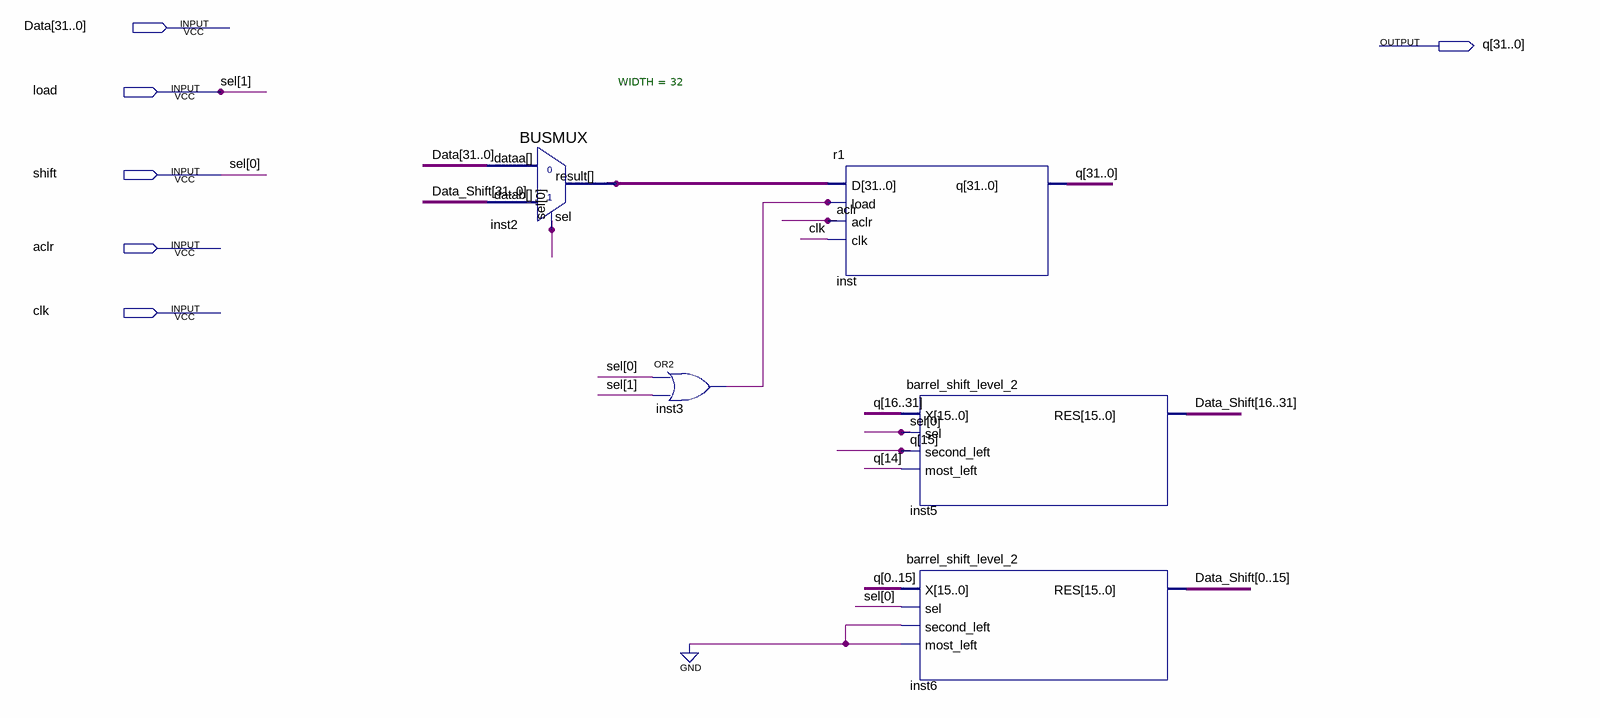
[diagram p0: schematic sheet]
// Quartus schematic r4.bdf as structural Verilog: 5 symbols, 6 pins
module r4 (
  input  [31:0] Data,
  input  load,
  input  shift,
  input  aclr,
  input  clk,
  output [31:0] q
);

  wire inst3_out;
  wire [31:0] Data_Shift, inst2_result;

  BUSMUX #(.WIDTH(32)) inst2 (.datab(Data_Shift), .sel(shift), .dataa(Data), .result(inst2_result));
  or inst3 (inst3_out, shift, load);
  r1 inst (.D(inst2_result), .load(inst3_out), .aclr(aclr), .clk(clk), .q(q));
  barrel_shift_level_2 inst5 (
    .X({q[16], q[17], q[18], q[19], q[20], q[21], q[22], q[23], q[24], q[25], q[26], q[27], q[28], q[29], q[30], q[31]}),
    .sel(shift), .second_left(q[15]), .most_left(q[14]),
    .RES({Data_Shift[16], Data_Shift[17], Data_Shift[18], Data_Shift[19], Data_Shift[20], Data_Shift[21], Data_Shift[22], Data_Shift[23], Data_Shift[24], Data_Shift[25], Data_Shift[26], Data_Shift[27], Data_Shift[28], Data_Shift[29], Data_Shift[30], Data_Shift[31]}));
  barrel_shift_level_2 inst6 (
    .X({q[0], q[1], q[2], q[3], q[4], q[5], q[6], q[7], q[8], q[9], q[10], q[11], q[12], q[13], q[14], q[15]}),
    .sel(shift), .second_left(1'b0), .most_left(1'b0),
    .RES({Data_Shift[0], Data_Shift[1], Data_Shift[2], Data_Shift[3], Data_Shift[4], Data_Shift[5], Data_Shift[6], Data_Shift[7], Data_Shift[8], Data_Shift[9], Data_Shift[10], Data_Shift[11], Data_Shift[12], Data_Shift[13], Data_Shift[14], Data_Shift[15]}));

  // Other names for the same wires on the sheet: sel[1:0] = {load, shift}
endmodule
